# Altium project LCD_Board_2.PrjPcb
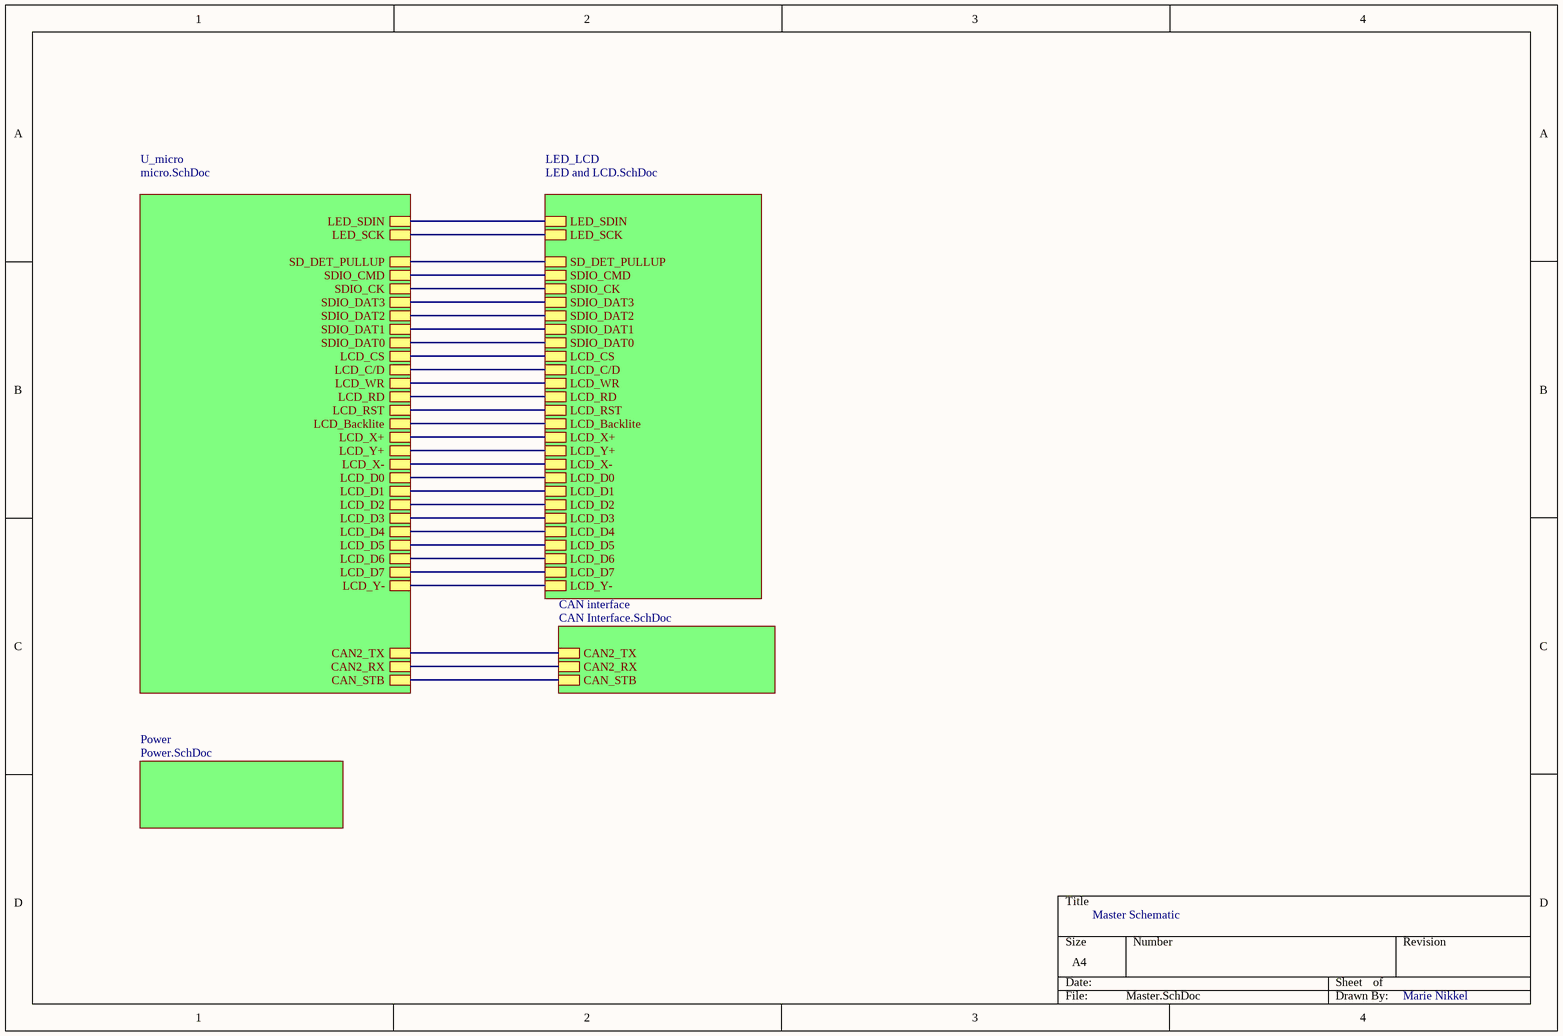
[diagram p0: Master.SchDoc]
5 sheets, 78 parts. Net scope: hierarchical (ports join the sheet entries above them; power ports are global).
Board file: LCD_Board_2.PcbDoc
Sheets:
  Master.SchDoc
    U_micro = micro.SchDoc
    Power = Power.SchDoc
    CAN interface = CAN Interface.SchDoc
    LED_LCD = LED and LCD.SchDoc

## Sheet Master.SchDoc
size A4

### Sub-sheets
CAN interface = CAN Interface.SchDoc: CAN2_TX, CAN2_RX, CAN_STB
LED_LCD = LED and LCD.SchDoc: LCD_C/D, LCD_WR, LCD_RD, LCD_RST, LCD_CS, LCD_Backlite, LCD_D0, LCD_D1, LCD_D2, LCD_D3, LCD_D4, LCD_D5, LCD_D7, LCD_D6, SDIO_DAT0, SDIO_DAT1, SDIO_DAT2, SDIO_DAT3, SDIO_CK, SDIO_CMD, LED_SDIN, SD_DET_PULLUP, LCD_X+, LCD_Y+, LCD_X-, LCD_Y-, LED_SCK
Power = Power.SchDoc: no entries
U_micro = micro.SchDoc: LCD_CS, LCD_C/D, LCD_WR, LCD_RD, LCD_RST, LCD_Backlite, LCD_X+, LCD_Y+, LCD_X-, LCD_D0, LCD_D1, LCD_D2, LCD_D3, LCD_D4, LCD_D5, LCD_D6, LCD_D7, CAN2_TX, CAN2_RX, SDIO_DAT0, SDIO_DAT2, SDIO_DAT1, SDIO_DAT3, SDIO_CK, SDIO_CMD, CAN_STB, SD_DET_PULLUP, LED_SDIN, LED_SCK, LCD_Y-

### Nets
NetC14_2: sheet U_micro/LCD_RST, sheet LED_LCD/LCD_RST
NetCD1_1: sheet U_micro/SDIO_DAT2, sheet LED_LCD/SDIO_DAT2
NetCD1_2: sheet U_micro/SDIO_DAT3, sheet LED_LCD/SDIO_DAT3
NetCD1_3: sheet U_micro/SDIO_CMD, sheet LED_LCD/SDIO_CMD
NetCD1_5: sheet U_micro/SDIO_CK, sheet LED_LCD/SDIO_CK
NetCD1_7: sheet U_micro/SDIO_DAT0, sheet LED_LCD/SDIO_DAT0
NetCD1_8: sheet U_micro/SDIO_DAT1, sheet LED_LCD/SDIO_DAT1
NetCN4_2: sheet U_micro/LED_SCK, sheet LED_LCD/LED_SCK
NetCN4_3: sheet U_micro/LED_SDIN, sheet LED_LCD/LED_SDIN
NetJP1_1: sheet U_micro/CAN2_TX, sheet CAN interface/CAN2_TX
NetJP1_2: sheet U_micro/CAN2_RX, sheet CAN interface/CAN2_RX
NetJP4_2: sheet U_micro/SD_DET_PULLUP, sheet LED_LCD/SD_DET_PULLUP
NetLCD1_23: sheet U_micro/LCD_CS, sheet LED_LCD/LCD_CS
NetLCD1_24: sheet U_micro/LCD_C/D, sheet LED_LCD/LCD_C/D
NetLCD1_25: sheet U_micro/LCD_WR, sheet LED_LCD/LCD_WR
NetLCD1_26: sheet U_micro/LCD_RD, sheet LED_LCD/LCD_RD
NetLCD1_28: sheet U_micro/LCD_Backlite, sheet LED_LCD/LCD_Backlite
NetLCD1_29: sheet U_micro/LCD_X+, sheet LED_LCD/LCD_X+
NetLCD1_30: sheet U_micro/LCD_Y+, sheet LED_LCD/LCD_Y+
NetLCD1_31: sheet U_micro/LCD_X-, sheet LED_LCD/LCD_X-
NetLCD1_32: sheet U_micro/LCD_Y-, sheet LED_LCD/LCD_Y-
NetLCD1_33: sheet U_micro/LCD_D0, sheet LED_LCD/LCD_D0
NetLCD1_34: sheet U_micro/LCD_D1, sheet LED_LCD/LCD_D1
NetLCD1_35: sheet U_micro/LCD_D2, sheet LED_LCD/LCD_D2
NetLCD1_36: sheet U_micro/LCD_D3, sheet LED_LCD/LCD_D3
NetLCD1_37: sheet U_micro/LCD_D4, sheet LED_LCD/LCD_D4
NetLCD1_38: sheet U_micro/LCD_D5, sheet LED_LCD/LCD_D5
NetLCD1_39: sheet U_micro/LCD_D6, sheet LED_LCD/LCD_D6
NetLCD1_40: sheet U_micro/LCD_D7, sheet LED_LCD/LCD_D7
NetU2_48: sheet U_micro/CAN_STB, sheet CAN interface/CAN_STB

### Notes on the sheet
- Master Schematic
- Marie Nikkel

## Sheet micro.SchDoc
size A4
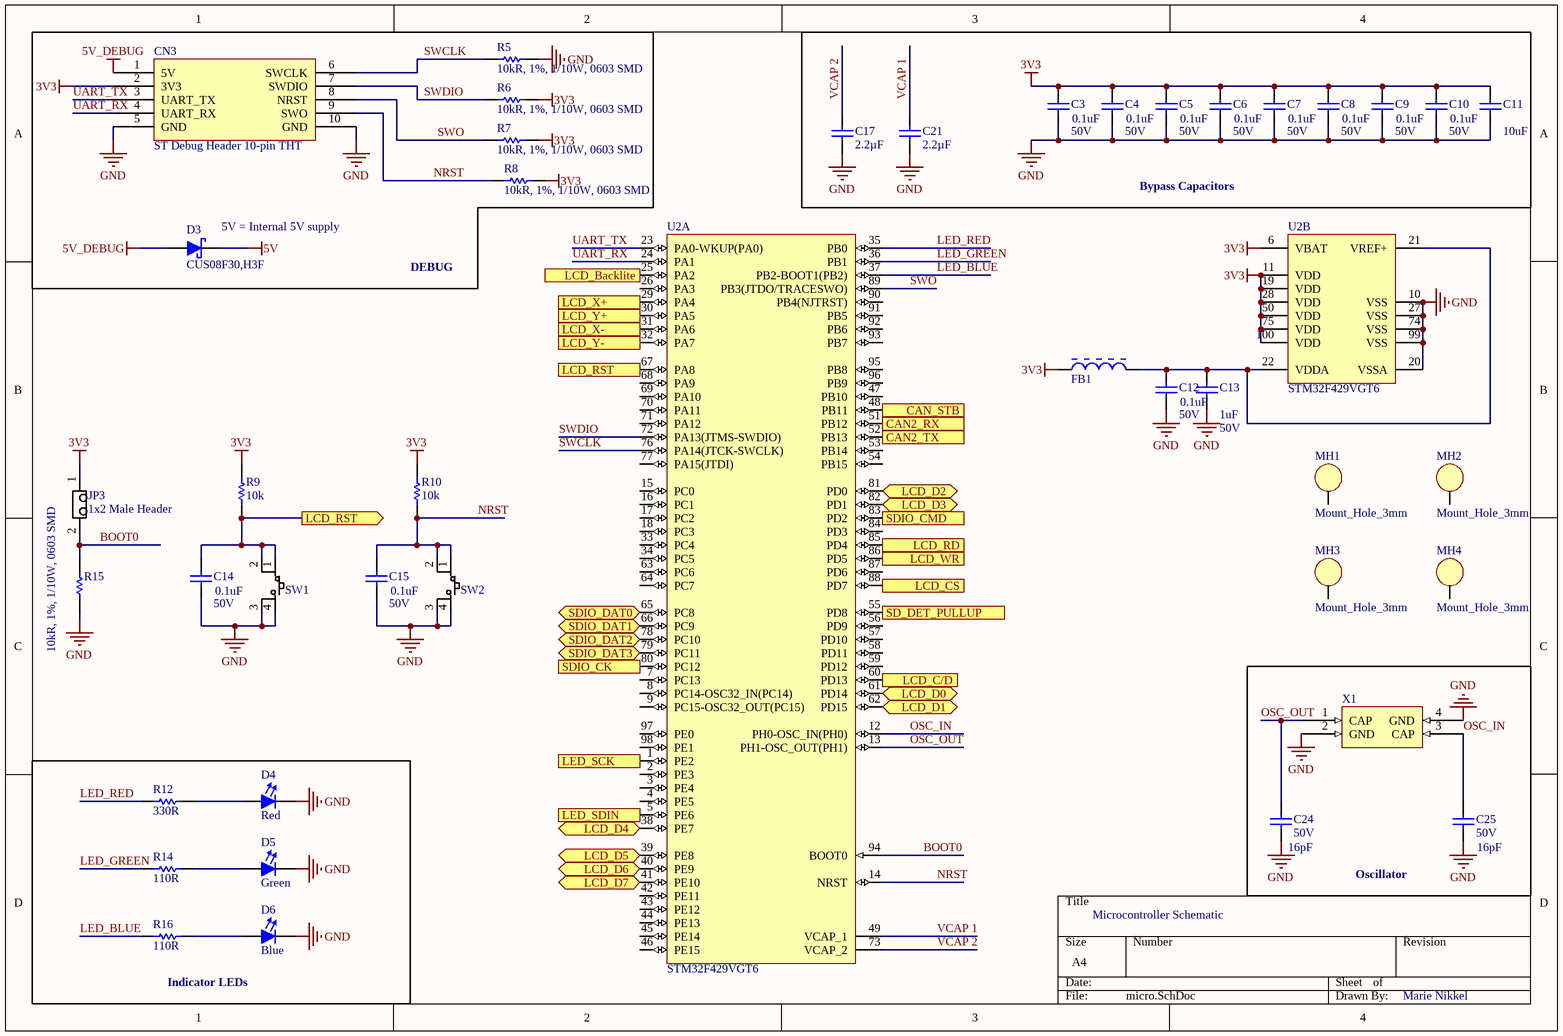
[diagram p1: micro.SchDoc]

### Parts
C3  Voltage: 50V  Capacitance: 0.1uF  [FP-CL10-0_1-IPC_A]  (hidden comment: CL10B104JB8NNNC)
C4  Voltage: 50V  Capacitance: 0.1uF  [FP-CL10-0_1-IPC_A]  (hidden comment: CL10B104JB8NNNC)
C5  Voltage: 50V  Capacitance: 0.1uF  [FP-CL10-0_1-IPC_A]  (hidden comment: CL10B104JB8NNNC)
C6  Voltage: 50V  Capacitance: 0.1uF  [FP-CL10-0_1-IPC_A]  (hidden comment: CL10B104JB8NNNC)
C7  Voltage: 50V  Capacitance: 0.1uF  [FP-CL10-0_1-IPC_A]  (hidden comment: CL10B104JB8NNNC)
C8  Voltage: 50V  Capacitance: 0.1uF  [FP-CL10-0_1-IPC_A]  (hidden comment: CL10B104JB8NNNC)
C9  Voltage: 50V  Capacitance: 0.1uF  [FP-CL10-0_1-IPC_A]  (hidden comment: CL10B104JB8NNNC)
C10  Voltage: 50V  Capacitance: 0.1uF  [FP-CL10-0_1-IPC_A]  (hidden comment: CL10B104JB8NNNC)
C11  Capacitance: 10uF  [CAPC3216X180X50ML20T30]  (hidden comment: CL31B106KBHNNNE)
C12  Voltage: 50V  Capacitance: 0.1uF  [FP-CL10-0_1-IPC_A]  (hidden comment: CL10B104JB8NNNC)
C13  Capacitance: 1uF  Voltage: 50V  [0803 CAP]  (hidden comment: CL21B105KBFNNNG)
C14  Voltage: 50V  Capacitance: 0.1uF  [FP-CL10-0_1-IPC_A]  (hidden comment: CL10B104JB8NNNC)
C15  Voltage: 50V  Capacitance: 0.1uF  [FP-CL10-0_1-IPC_A]  (hidden comment: CL10B104JB8NNNC)
C17  value 2.2µF  [CAPC1608N(0603")]  (hidden comment: 2.2uF, 50V, 0603 SMD, X5R, Ceramic)
C21  value 2.2µF  [CAPC1608N(0603")]  (hidden comment: 2.2uF, 50V, 0603 SMD, X5R, Ceramic)
C24  Voltage: 50V  Capacitance: 16pF  [CAPC1608X90X35ML10T15]  (hidden comment: 16pF Ceramic 50V 5% 0603)
C25  Voltage: 50V  Capacitance: 16pF  [CAPC1608X90X35ML10T15]  (hidden comment: 16pF Ceramic 50V 5% 0603)
CN3  ST Debug Header 10-pin THT  [10-pin shrouded header THT]
D3  CUS08F30,H3F  [SC-76]
D4  Color: Red  [FP-LB_Q39E-MFG]  (hidden comment: LSQ976-NR-1)
D5  Color: Green  [FP-LB_Q39E-MFG]  (hidden comment: LT Q39G-Q1OO-25-1)
D6  Color: Blue  [FP-LB_Q39E-MFG]  (hidden comment: LBQ39E-N1OO-35-1)
FB1  BLM18AG601SN1D  [MURA-BLM18-F-H1-CHIP-2_V]  (value not drawn)
JP3  1x2 Male Header  [2X1 Males Header]
MH1  Mount_Hole_3mm  [Mount-Hole_3mm]
MH2  Mount_Hole_3mm  [Mount-Hole_3mm]
MH3  Mount_Hole_3mm  [Mount-Hole_3mm]
MH4  Mount_Hole_3mm  [Mount-Hole_3mm]
R5  10kR, 1%, 1/10W, 0603 SMD  [RESC1608N(0603")]
R6  10kR, 1%, 1/10W, 0603 SMD  [RESC1608N(0603")]
R7  10kR, 1%, 1/10W, 0603 SMD  [RESC1608N(0603")]
R8  10kR, 1%, 1/10W, 0603 SMD  [RESC1608N(0603")]
R9  value 10k  [RESC1608N(0603")]  (hidden comment: 10kR, 1%, 1/10W, 0603 SMD)
R10  value 10k  [RESC1608N(0603")]  (hidden comment: 10kR, 1%, 1/10W, 0603 SMD)
R12  Resistance: 330R  [FP-CRCW0603-e3-IPC_C]  (hidden comment: CRCW0603330RFKEA)
R14  Resistance: 110R  [RESC1608X55X25ML10T15]  (hidden comment: RC0603FR-07110RL)
R15  10kR, 1%, 1/10W, 0603 SMD  [RESC1608N(0603")]
R16  Resistance: 110R  [RESC1608X55X25ML10T15]  (hidden comment: RC0603FR-07110RL)
SW1  PTS645SL43SMTR92LFS  [4-SPST-NO]  (value not drawn)
SW2  PTS645SL43SMTR92LFS  [4-SPST-NO]  (value not drawn)
U2  STM32F429VGT6  [STM-LQFP100_L]  (parts A,B of 2)
X1  CRYSTAL 8.0MHZ 16PF SMD  [QFN250P750X520X140_HS-5M]  (value not drawn)

### Blocks framed on the sheet
Bypass Capacitors: C3-C11 C17 C21
Oscillator: C24 C25 X1
Indicator LEDs: D4-D6 R12 R14 R16

### Ports
CAN2_RX (in), CAN2_TX (out), CAN_STB (out), LCD_Backlite (out), LCD_C/D (out), LCD_CS (out), LCD_D0 (bidir), LCD_D1 (bidir), LCD_D2 (bidir), LCD_D3 (bidir), LCD_D4 (bidir), LCD_D5 (bidir), LCD_D6 (bidir), LCD_D7 (bidir), LCD_RD (out), LCD_RST (out), LCD_WR (out), LCD_X+ (in), LCD_X- (in), LCD_Y+ (in), LCD_Y- (in), LED_SCK (out), LED_SDIN (out), SD_DET_PULLUP (out), SDIO_CK (out), SDIO_CMD (out), SDIO_DAT0 (bidir), SDIO_DAT1 (bidir), SDIO_DAT2 (bidir), SDIO_DAT3 (bidir)

### Nets
3V3: C3.2 C4.2 C5.2 C6.2 C7.2 C8.2 C9.2 C10.2 C11.2 CN3.2(3V3) FB1.1 JP3.1 R6.2 R7.2 R8.2 R9.2 R10.2 U2.6(VBAT) U2.11(VDD) U2.19(VDD) U2.28(VDD) U2.50(VDD) U2.75(VDD) U2.100(VDD)
5V: D3.K(Cathode)
5V_DEBUG: CN3.1(5V) D3.A(Anode)
GND: C3.1 C4.1 C5.1 C6.1 C7.1 C8.1 C9.1 C10.1 C11.1 C12.1 C13.1 C14.1 C15.1 C17.1(Anode) C21.1(Anode) C24.1 C25.1 CN3.5(GND) CN3.10(GND) D4.1(Cathode) D5.1(Cathode) D6.1(Cathode) R5.2 R15.1 SW1.3 SW1.4 SW2.3 SW2.4 U2.10(VSS) U2.20(VSSA) U2.27(VSS) U2.74(VSS) U2.99(VSS) X1.2(GND) X1.4(GND)
BOOT0: JP3.2 R15.2 U2.94(BOOT0)
LED_BLUE: R16.1 U2.37(PB2-BOOT1(PB2))
LED_GREEN: R14.1 U2.36(PB1)
LED_RED: R12.1 U2.35(PB0)
NRST: C15.2 CN3.9(SWO) R8.1 R10.1 SW2.1 SW2.2 U2.14(NRST)
OSC_IN: C25.2 U2.12(PH0-OSC_IN(PH0)) X1.3(CAP)
OSC_OUT: C24.2 U2.13(PH1-OSC_OUT(PH1)) X1.1(CAP)
SWCLK: CN3.6(SWCLK) R5.1 U2.76(PA14(JTCK-SWCLK))
SWDIO: CN3.7(SWDIO) R6.1 U2.72(PA13(JTMS-SWDIO))
SWO: CN3.8(NRST) R7.1 U2.89(PB3(JTDO/TRACESWO))
UART_RX: CN3.4(UART_RX) U2.24(PA1)
UART_TX: CN3.3(UART_TX) U2.23(PA0-WKUP(PA0))
VCAP 1: C21.2(Cathode) U2.49(VCAP_1)
VCAP 2: C17.2(Cathode) U2.73(VCAP_2)
NetC12_2: C12.2 C13.2 FB1.2 U2.21(VREF+) U2.22(VDDA)
NetC14_2: C14.2 R9.1 SW1.1 SW1.2 U2.67(PA8) ; port LCD_RST
NetCD1_1: U2.78(PC10) ; port SDIO_DAT2
NetCD1_2: U2.79(PC11) ; port SDIO_DAT3
NetCD1_3: U2.83(PD2) ; port SDIO_CMD
NetCD1_5: U2.80(PC12) ; port SDIO_CK
NetCD1_7: U2.65(PC8) ; port SDIO_DAT0
NetCD1_8: U2.66(PC9) ; port SDIO_DAT1
NetCN4_2: U2.1(PE2) ; port LED_SCK
NetCN4_3: U2.5(PE6) ; port LED_SDIN
NetD4_2: D4.2(Anode) R12.2
NetD5_2: D5.2(Anode) R14.2
NetD6_2: D6.2(Anode) R16.2
NetJP1_1: U2.52(PB13) ; port CAN2_TX
NetJP1_2: U2.51(PB12) ; port CAN2_RX
NetJP4_2: U2.55(PD8) ; port SD_DET_PULLUP
NetLCD1_23: U2.88(PD7) ; port LCD_CS
NetLCD1_24: U2.60(PD13) ; port LCD_C/D
NetLCD1_25: U2.86(PD5) ; port LCD_WR
NetLCD1_26: U2.85(PD4) ; port LCD_RD
NetLCD1_28: U2.25(PA2) ; port LCD_Backlite
NetLCD1_29: U2.29(PA4) ; port LCD_X+
NetLCD1_30: U2.30(PA5) ; port LCD_Y+
NetLCD1_31: U2.31(PA6) ; port LCD_X-
NetLCD1_32: U2.32(PA7) ; port LCD_Y-
NetLCD1_33: U2.61(PD14) ; port LCD_D0
NetLCD1_34: U2.62(PD15) ; port LCD_D1
NetLCD1_35: U2.81(PD0) ; port LCD_D2
NetLCD1_36: U2.82(PD1) ; port LCD_D3
NetLCD1_37: U2.38(PE7) ; port LCD_D4
NetLCD1_38: U2.39(PE8) ; port LCD_D5
NetLCD1_39: U2.40(PE9) ; port LCD_D6
NetLCD1_40: U2.41(PE10) ; port LCD_D7
NetU2_48: U2.48(PB11) ; port CAN_STB

Not connected (* = marked no-connect by the designer): MH1 1; MH2 1; MH3 1; MH4 1; U2 2(PE3) 3(PE4) 4(PE5) 7(PC13) 8(PC14-OSC32_IN(PC14)) 9(PC15-OSC32_OUT(PC15)) 15(PC0) 16(PC1) 17(PC2) 18(PC3) 26(PA3) 33(PC4) 34(PC5) 42(PE11) 43(PE12) 44(PE13) 45(PE14) 46(PE15) 47(PB10) 53(PB14) 54(PB15) 56(PD9) 57(PD10) 58(PD11) 59(PD12) 63(PC6) 64(PC7) 68(PA9) 69(PA10) 70(PA11) 71(PA12) 77(PA15(JTDI)) 84(PD3) 87(PD6) 90(PB4(NJTRST)) 91(PB5) 92(PB6) 93(PB7) 95(PB8) 96(PB9) 97(PE0) 98(PE1)

### Notes on the sheet
- (near D3) 5V = Internal 5V supply
- DEBUG
- Microcontroller Schematic
- Marie Nikkel

### Library data of the parts
C3 = CMP-00000-4: CAP CER 0.1UF 50V X7R 0603; Tolerance: 5%; Material: Ceramic; Case Code (Imperial): 0603; Mount: Surface Mount; Thickness: 0.035inch; Depth: 0.8mm; Packaging: Tape and Reel; Package Quantity: 1; Dielectric: X7R; Height: 0.8mm; Radiation Hardening: No; Max Operating Temperature: 125°C; Voltage Rating: 50V; Case/Package: 0603; Min Operating Temperature: -55°C; Case Code (Metric): 1608; Length: 1.6mm; Contact Plating: Tin; Width: 0.031inch
C4-C10 C12 C14 C15 = CMP-00000-3: CAP CER 0.1UF 50V X7R 0603; Tolerance: 5%; Material: Ceramic; Case Code (Imperial): 0603; Mount: Surface Mount; Thickness: 0.035inch; Depth: 0.8mm; Packaging: Tape and Reel; Package Quantity: 1; Dielectric: X7R; Height: 0.8mm; Radiation Hardening: No; Max Operating Temperature: 125°C; Voltage Rating: 50V; Case/Package: 0603; Min Operating Temperature: -55°C; Case Code (Metric): 1608; Length: 1.6mm; Contact Plating: Tin; Width: 0.031inch
C11 = CMP-00004-1: Cap Ceramic 10uF 50V X7R 10% Pad SMD 1206 125°C T/R; Thickness: 0.071inch; Case/Package: 1206; Case Code (Metric): 3216; Case Code (Imperial): 1206; Voltage Rating: 50V; Length: 0.126inch; Max Operating Temperature: 125°C; Voltage Rating (DC): 50V; Dielectric: X7R; Lead Free: Lead Free; Min Operating Temperature: -55°C; Tolerance: 10%; Mount: Surface Mount; Packaging: Tape and Reel; Width: 0.063inch
C13 = CMP-00005-3: SAMSUNG ELECTRO-MECHANICS - CL21B105KBFNNNG - MLCC CAPACITORS; Tolerance: 10%; Material: Ceramic; Dielectric: X7R; Case/Package: 0805; Voltage Rating: 50V; Contact Plating: Tin; Max Operating Temperature: 125°C; Termination: Wraparound; Package Quantity: 3000; Depth: 1.25mm; Mount: Surface Mount; Min Operating Temperature: -55°C; Thickness: 0.053inch; Packaging: Tape and Reel; Case Code (Metric): 2012; Length: 2mm; Case Code (Imperial): 0805; Width: 0.049inch
C17 C21 = CMP-006-0030-1: Capacitor, Ceramic, 50V, 10%, 0603 SMD, X5R; Date Created: *; Design Item ID: 2.2uF, 50V, 0603 SMD, X5R, Ceramic; Made By: *; Publisher: AUVic; Source: AUVic_Schematic_Library_Capacitors.SchLib; Pin Count: 2; PackageDescription: Chip Capacitor; Component Type: Standard
C24 C25 = CMP-00087-2: Cap Ceramic 16pF 50V C0G 5% SMD 0603 125C Paper T/R; Temperature Coefficient: 30ppm/°C; Termination: SMD/SMT; Voltage Rating: 50V; Dielectric: C0G; Radiation Hardening: No; Voltage Rating (DC): 50V; Max Operating Temperature: 125°C; Height: 0.8mm; Width: 0.8mm; Length: 1.6mm; Package Quantity: 1; Lead Free: Lead Free; Min Operating Temperature: -55°C; Case Code (Metric): 1608; Case/Package: 0603; Tolerance: 5%; Mount: Surface Mount; Thickness: 0.035inch; Case Code (Imperial): 0603; Depth: 0.8mm; Packaging: Tape and Reel
CN3 = CMP-00011-6: CONN HEADER VERT 10POS 2.54MM; Row Spacing: 0.1inch; Connector Type: Male Pin; Number of Positions: 10; Packaging: Tray; Package Quantity: 1; Color: Black; Number of Rows: 2; Termination: Solder; Contact Plating: Gold; Lead Free: Lead Free; Pitch: 0.1inch; Mount: Through Hole
D3 = CMP-057-0000-2: Diode Schottky 30V 800mA Surface Mount USC; Peak Non-Repetitive Surge Current: 5A; Element Configuration: Single; Peak Reverse Current: 50uA; Packaging: Tape and Reel; Mount: Surface Mount; Average Rectified Current: 800mA; Case/Package: SOD; Max Reverse Voltage (DC): 30V; Min Operating Temperature: -55°C; Contact Plating: Tin,Silver; Max Repetitive Reverse Voltage (Vrrm): 30V; Number of Pins: 2; Max Operating Temperature: 125°C
D4 = CMP-00066-2: LED Red 645nm 2-Pin Chip 0603(1608Metric) T/R; Lens Transparency: Diffused; Power Dissipation: 65mW; Forward Voltage: 2.5V; Dominant Wavelength: 633nm; Number of Elements: 1; Lens Style: Diffused,Flat,Colorless,Rectangular; Lens Color: White; Viewing Angle: 160°; Luminous Flux: 0.33lm; Test Current: 20mA; Forward Current: 25mA; Luminous Intensity: 180mcd; Reverse Voltage: 12V; Lens Size: 0.8mm; Max Operating Temperature: 85°C; Depth: 0.9mm; Illumination Color: Red; Packaging: Tape and Reel; Min Operating Temperature: -30°C; Case Code (Imperial): 0603; Case Code (Metric): 1608; Number of Pins: 2; Mount: Surface Mount; Height: 0.8mm; Package Quantity: 1; Length: 1.7mm; Width: 0.8mm; Number of LEDs: 1; Case/Package: 0603; Radiation Hardening: No
D5 = CMP-00064-3: LED GREEN DIFFUSED 0603 SMD; Dominant Wavelength: 530nm; Luminous Intensity: 280mcd; Lens Style: Diffused,Colorless,Rectangular; Number of LEDs: 1; Forward Voltage: 2.85V; Test Current: 5mA; Reverse Voltage: 5V; Forward Current: 15mA; Luminous Flux: 0.55lm; Radiation Hardening: No; Packaging: Tape and Reel; Mount: Surface Mount; Max Operating Temperature: 85°C; Number of Elements: 1; Number of Pins: 2; Min Operating Temperature: -40°C; Depth: 0.9mm; Case/Package: SMD/SMT; Length: 1.7mm
D6 = CMP-00063-3: LED BLUE DIFFUSED 0603 SMD; Luminous Flux: 0.13lm; Lens Size: 0.8mm; Lens Color: White; Viewing Angle: 130°; Luminous Intensity: 42mcd; Number of LEDs: 1; Dominant Wavelength: 470nm; Lens Style: Flat,Diffused,Colorless,Rectangular; Test Current: 5mA; Forward Voltage: 2.85V; Packaging: Tape and Reel; Case/Package: 0603; Height: 0.4mm; Number of Pins: 2; Mount: Surface Mount; Case Code (Metric): 1608; Case Code (Imperial): 0603; Lens Transparency: Diffused; Width: 0.8mm; Length: 1.6mm; Radiation Hardening: No
FB1 = CMP-00016-1: MURATA - BLM18AG601SN1D - Feritový Korálek, 0603 / 1608, 600 ohm, 500 mA, Série BLM18A, 0.38 ohm, ± 25%; DC Current: 500mA; Impedance: 600R; DC Resistance (DCR): 380mR; Core Material: Ferrite; Shielding: Unshielded; Number of Lines: 1; Test Frequency: 100MHz; Material: Steel,Ferrite; Height: 0.8mm; Depth: 0.8mm; Min Operating Temperature: -55°C; Packaging: Tape and Reel; Weight: 7.1E-05oz; Width: 0.8mm; Military Standard: Not; Max Operating Temperature: 125°C; Max Current Rating: 500mA; Case Code (Metric): 1608; Length: 1.6mm; Case Code (Imperial): 0603; Package Quantity: 1; Max DC Current: 500mA; REACH SVHC: No SVHC; Termination: SMD/SMT; Current Rating: 500mA; Lead Free: Lead Free; Tolerance: 25%; Case/Package: 0603; Number of Pins: 2; Radiation Hardening: No; Frequency: 100MHz; Number of Circuits: 1
JP3 = CMP-004-0001-1: Made By: Andy Bates; Source: AUVic_Schematic_Library_Connectors.SchLib; Pin Count: 2; Design Item ID: 1x2 Male Header; Component Type: Standard
MH1-MH4 = CMP-004-0010-4: Mounting hold for M3 hex standoff; Design Item ID: Mount_Hole_3mm; Pin Count: 1; Source: AUVic_Schematic_Library_Connectors.SchLib; Component Type: Standard
R5-R8 R15 = CMP-047-0013-1: Owned By: AUVic; Made By: Ashwin Sira; Value: 10k; Design Item ID: 10kR, 1%, 1/10W, 0603 SMD; Pin Count: 2; Component Type: Standard; Created On: 14-05-31; Last Edited: 14-05-31; Source: AUVic_Schematic_Library_Resistors.SchLib
R9 R10 = CMP-047-0013-1: Owned By: AUVic; Made By: Ashwin Sira; Design Item ID: 10kR, 1%, 1/10W, 0603 SMD; Pin Count: 2; Component Type: Standard; Created On: 14-05-31; Last Edited: 14-05-31; Source: AUVic_Schematic_Library_Resistors.SchLib
R12 = CMP-00067-2: Res Thick Film 0603 330 Ohm 1% 0.1W(1/10W) +/-100ppm/ßC Pad SMD Automotive T/R; Voltage Rating (DC): 75V; Power Rating: 100mW; Temperature Coefficient: 100ppm/°C; Contact Plating: Tin; Package Quantity: 10; Tolerance: 1%; Packaging: Tape and Reel; Case/Package: 0603; Max Operating Temperature: 155°C; Case Code (Metric): 1608; Case Code (Imperial): 0603; Min Operating Temperature: -55°C; Length: 1.55mm; Height: 0.45mm; Lead Free: Lead Free; Termination: SMD/SMT; Voltage Rating: 75V; Composition: Thick Film; Weight: 7.1E-05oz; Military Standard: Not; Max Power Dissipation: 100mW; REACH SVHC: Unknown; Mount: Surface Mount; Depth: 0.85mm; Features: Automotive AEC-Q200; Number of Terminations: 2; Radiation Hardening: No; Width: 0.033inch
R14 R16 = CMP-00069-1: RES SMD 110 OHM 1% 1/10W 0603; Max Power Dissipation: 100mW; Voltage Rating (DC): 50V; Temperature Coefficient: 100ppm/°C; Working Voltage: 75V; Military Standard: Not; Termination: SMD/SMT; Number of Terminations: 2; Features: Moisture Resistant; Min Operating Temperature: -55°C; Power Rating: 100mW; Height: 0.022inch; Package Quantity: 1; Lead Free: Lead Free; Tolerance: 1%; Voltage Rating: 50V; Composition: Thick Film; Case Code (Imperial): 0603; Length: 1.6mm; Packaging: Tape and Reel; Case Code (Metric): 1608; Max Operating Temperature: 155°C; Depth: 0.8mm; Case/Package: 0603; Width: 0.031inch
SW1 SW2 = CMP-00077-1: Black Switch Tactile N.O. SPST Round Button Gull Wing 0.05A 12VDC 100000Cycles 1.27N SMD T/R; Actuator Type: Standard; Current Rating: 50mA; Switch Function: Off-Mom; Actuator Length: 0.85mm; Contact Resistance: 100mR; Max Voltage Rating (DC): 12V; Actuator Material: Nylon,Polyamide; Illumination Type: Non-Illuminated; Orientation: Straight; Mechanical Life: 100000Cycles; Package Quantity: 1000; Operating Force: 1.27N; Color: Black; Button Colour: Black; Max Operating Temperature: 60°C; Length: 6mm; Contact Plating: Silver; Termination: Gull Wing; Min Operating Temperature: -20°C; Mount: Surface Mount; Voltage Rating (DC): 12V; Max Current Rating: 50mA; Lead Free: Lead Free; Depth: 9mm; Packaging: Tape and Reel; Throw Configuration: SPST; Contact Material: Bronze,Brass,Silver
U2 = CMP-00008-1: MCU 32-bit STM32F ARM Cortex M4 RISC 1024KB Flash 2.5V/3.3V 100-Pin LQFP Tray; Number of ADC Channels: 24; Max Power Dissipation: 465mW; Number of I/Os: 82; Oscillator Type: Internal; Frequency: 180MHz; Peripherals: Brown-out Detect/Reset,POR,PWM,WDT,DMA,LCD; Data Bus Width: 32b; Number of UART Channels: 4; Interface: I2C,SPI,USB,CAN,IrDA,UART,USART,LIN,EBI/EMI,SDIO,Ethernet,I2S; Min Supply Voltage: 1.8V; Memory Size: 1MB; Number of Ethernet Channels: 1; Number of I2C Channels: 3; Number of SPI Channels: 6; Number of Timers/Counters: 14; Number of USB Channels: 2; Max Supply Voltage: 3.6V; RAM Size: 256KB; Watchdog Timer: Yes; Case/Package: LQFP; Length: 14.2mm; Number of Programmable I/O: 82; Min Operating Temperature: -40°C; REACH SVHC: No SVHC; Number of Pins: 100; Lead Free: Lead Free; Core Architecture: ARM; Radiation Hardening: No; Memory Type: FLASH; Packaging: Tray; Width: 14.2mm; Package Quantity: 540; Max Operating Temperature: 85°C; Max Frequency: 180MHz; Height: 1.45mm
X1 = CMP-00079-3: 8MHz ±30ppm Crystal 16pF 80 Ohms 4-SMD, No Lead; Frequency Stability: 50ppm; ESR (Equivalent Series Resistance): 80R; Packaging: Tape and Reel; Min Operating Temperature: -20°C; Length: 7.5mm; Case/Package: CSMD; Max Operating Temperature: 70°C; Load Capacitance: 16pF; Depth: 5.2mm; Frequency: 8MHz; Number of Pins: 4

## Sheet Power.SchDoc
size A
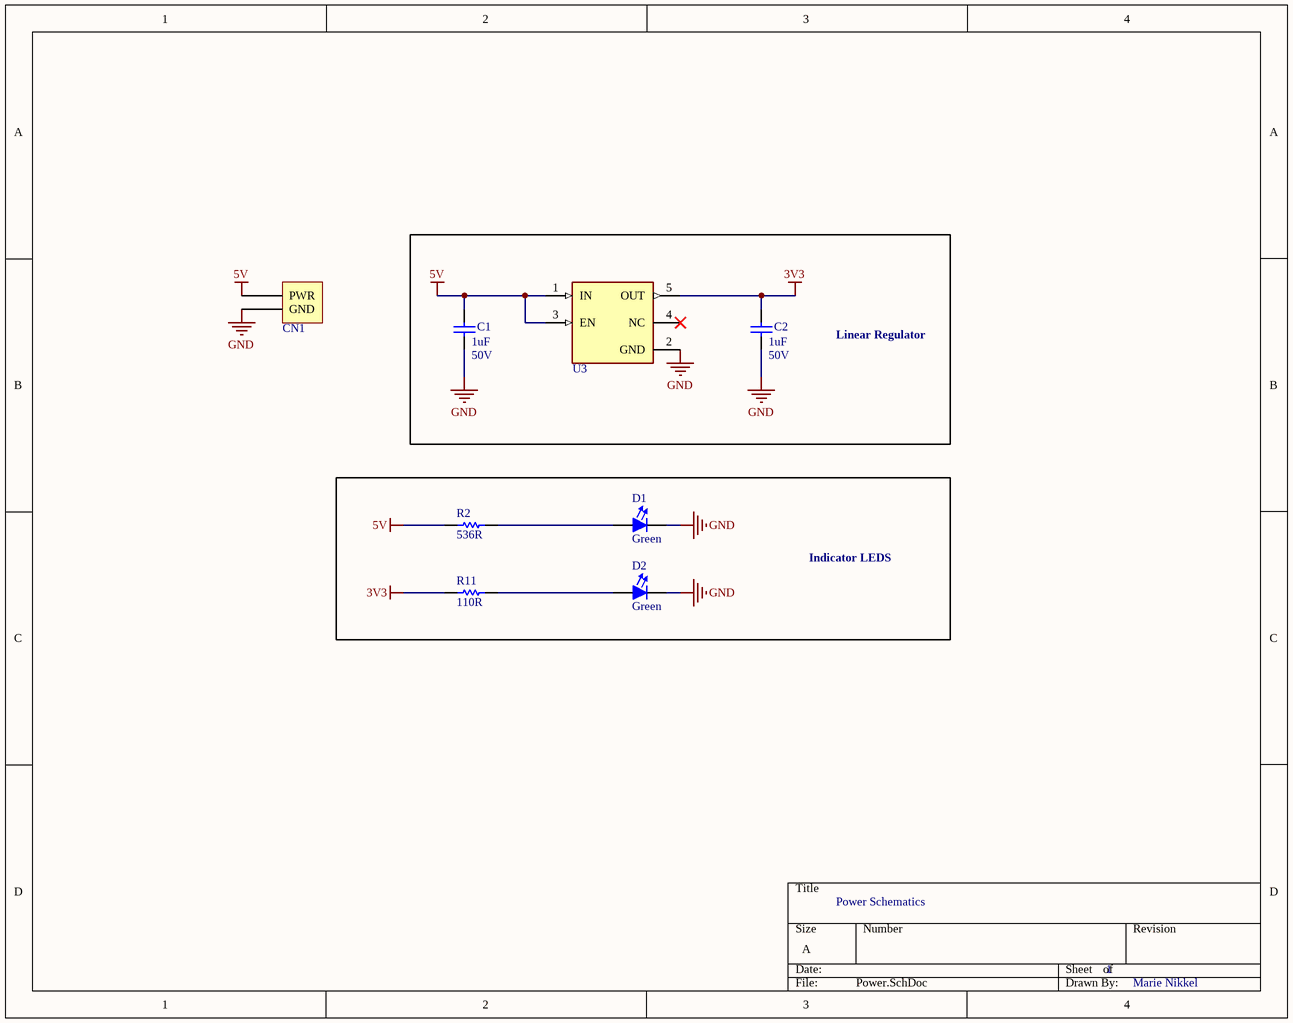
[diagram p2: Power.SchDoc]

### Parts
C1  Capacitance: 1uF  Voltage: 50V  [0803 CAP]  (hidden comment: CL21B105KBFNNNG)
C2  Capacitance: 1uF  Voltage: 50V  [0803 CAP]  (hidden comment: CL21B105KBFNNNG)
CN1  Header, Female, 1x2, Right Angle, Pitch 0.118" (3.00mm), THT  [New footprint 1]  (value not drawn)
D1  Color: Green  [FP-LB_Q39E-MFG]  (hidden comment: LT Q39G-Q1OO-25-1)
D2  Color: Green  [FP-LB_Q39E-MFG]  (hidden comment: LT Q39G-Q1OO-25-1)
R2  Resistance: 536R  [RESC1608X55X30NL15T15]  (hidden comment: ERJ-3EKF5360V)
R11  Resistance: 110R  [RESC1608X55X25ML10T15]  (hidden comment: RC0603FR-07110RL)
U3  TLV75533PDBVR  [FP-DBV0005A-IPC_B]  (value not drawn)

### Blocks framed on the sheet
Linear Regulator: C1 C2 U3
Indicator LEDS: D1 D2 R2 R11

### Nets
3V3: C2.1 R11.1 U3.5(OUT)
5V: C1.1 CN1.2(PWR) R2.1 U3.1(IN) U3.3(EN)
GND: C1.2 C2.2 CN1.1(GND) D1.1(Cathode) D2.1(Cathode) U3.2(GND)
NetD1_2: D1.2(Anode) R2.2
NetD2_2: D2.2(Anode) R11.2

Not connected (* = marked no-connect by the designer): U3 4(NC)*

### Notes on the sheet
- Power Schematics
- 1
- Marie Nikkel

### Library data of the parts
C1 C2 = CMP-00005-3: as C13 on sheet micro; Case/Package: 0805; Voltage Rating: 50V; Contact Plating: Tin; Max Operating Temperature: 125°C; Termination: Wraparound; Package Quantity: 3000; Depth: 1.25mm; Mount: Surface Mount; Min Operating Temperature: -55°C; Thickness: 0.053inch; Packaging: Tape and Reel; Case Code (Metric): 2012; Length: 2mm; Case Code (Imperial): 0805; Width: 0.049inch
CN1 = CMP-00001-4: Connector Header Through Hole, Right Angle 2 position; Gender: Male; Max Voltage Rating (DC): 250.25kV; Number of Contacts: 2; Current Rating: 5A; Glow Wire Compliant: Compliant; Voltage Rating: 600V; Voltage Rating (DC): 250V; Insulation Resistance: 1GR; Pitch: 3mm; Contact Resistance: 10mR; Length: 7.15mm; Contact Material: Brass; Housing Color: Black; Contact Plating: Gold; Packaging: Tray; Mount: Through Hole; Diameter: 3mm; Housing Material: Thermoplastic; Case/Package: SMC; Depth: 12.2mm; Termination: Solder; Color: Black; Max Current Rating: 5A; Number of Positions: 2; Lead Free: Contains Lead; Min Operating Temperature: -40°C; Number of Rows: 2; Height: 8.77mm; Package Quantity: 3168; Number of Circuits: 2; Max Operating Temperature: 105°C; Radiation Hardening: No; Flammability Rating: UL94 V-0; Orientation: Right Angle; Halogen Free: Low Halogen
D1 D2 = CMP-00064-3: as D5 on sheet micro; Radiation Hardening: No; Packaging: Tape and Reel; Mount: Surface Mount; Max Operating Temperature: 85°C; Number of Elements: 1; Number of Pins: 2; Min Operating Temperature: -40°C; Depth: 0.9mm; Case/Package: SMD/SMT; Length: 1.7mm
R2 = CMP-00071-1: SMD Chip Resistor, 0603 [1608 Metric], 536 ohm, ERJ3EK Series, 75 V, Thick Film, 100 mW; Tolerance: 1%; Voltage Rating (DC): 50V; Voltage Rating: 75V; Power Rating: 100mW; Temperature Coefficient: 100ppm/°C; Max Operating Temperature: 155°C; Package Quantity: 1; REACH SVHC: No SVHC; Depth: 0.8mm; Composition: Thick Film; Height: 0.022inch; Packaging: Tape and Reel; Contact Plating: Tin; Lead Free: Lead Free; Length: 1.6mm; Case/Package: 0603; Military Standard: Not; Features: Automotive AEC-Q200; Termination: SMD/SMT; Max Power Dissipation: 100mW; Width: 0.8mm; Mount: Surface Mount; Case Code (Metric): 1608; Case Code (Imperial): 0603; Number of Terminations: 2; Min Operating Temperature: -55°C
R11 = CMP-00069-1: as R14 on sheet micro; Military Standard: Not; Termination: SMD/SMT; Number of Terminations: 2; Features: Moisture Resistant; Min Operating Temperature: -55°C; Power Rating: 100mW; Height: 0.022inch; Package Quantity: 1; Lead Free: Lead Free; Tolerance: 1%; Voltage Rating: 50V; Composition: Thick Film; Case Code (Imperial): 0603; Length: 1.6mm; Packaging: Tape and Reel; Case Code (Metric): 1608; Max Operating Temperature: 155°C; Depth: 0.8mm; Case/Package: 0603; Width: 0.031inch
U3 = CMP-044-0002-1: 500-mA, high-PSRR, low-IQ, low-dropout voltage regulator with enable 5-SOT-23 -40 to 125; Max Input Voltage: 5.5V; Quiescent Current: 31uA; Output Current: 500mA; Dropout Voltage: 238mV; Output Configuration: Positive; Output Type: Fixed; Number of Regulators: 1; Min Output Voltage: 3.3V; Power Supply Rejection Ratio (PSRR): 52dB; Max Operating Temperature: 125°C; Mount: Surface Mount; Max Output Voltage: 3.3V; Packaging: Cut Tape; Case/Package: SOT-23-5; Min Operating Temperature: -40°C

## Sheet CAN Interface.SchDoc
size A
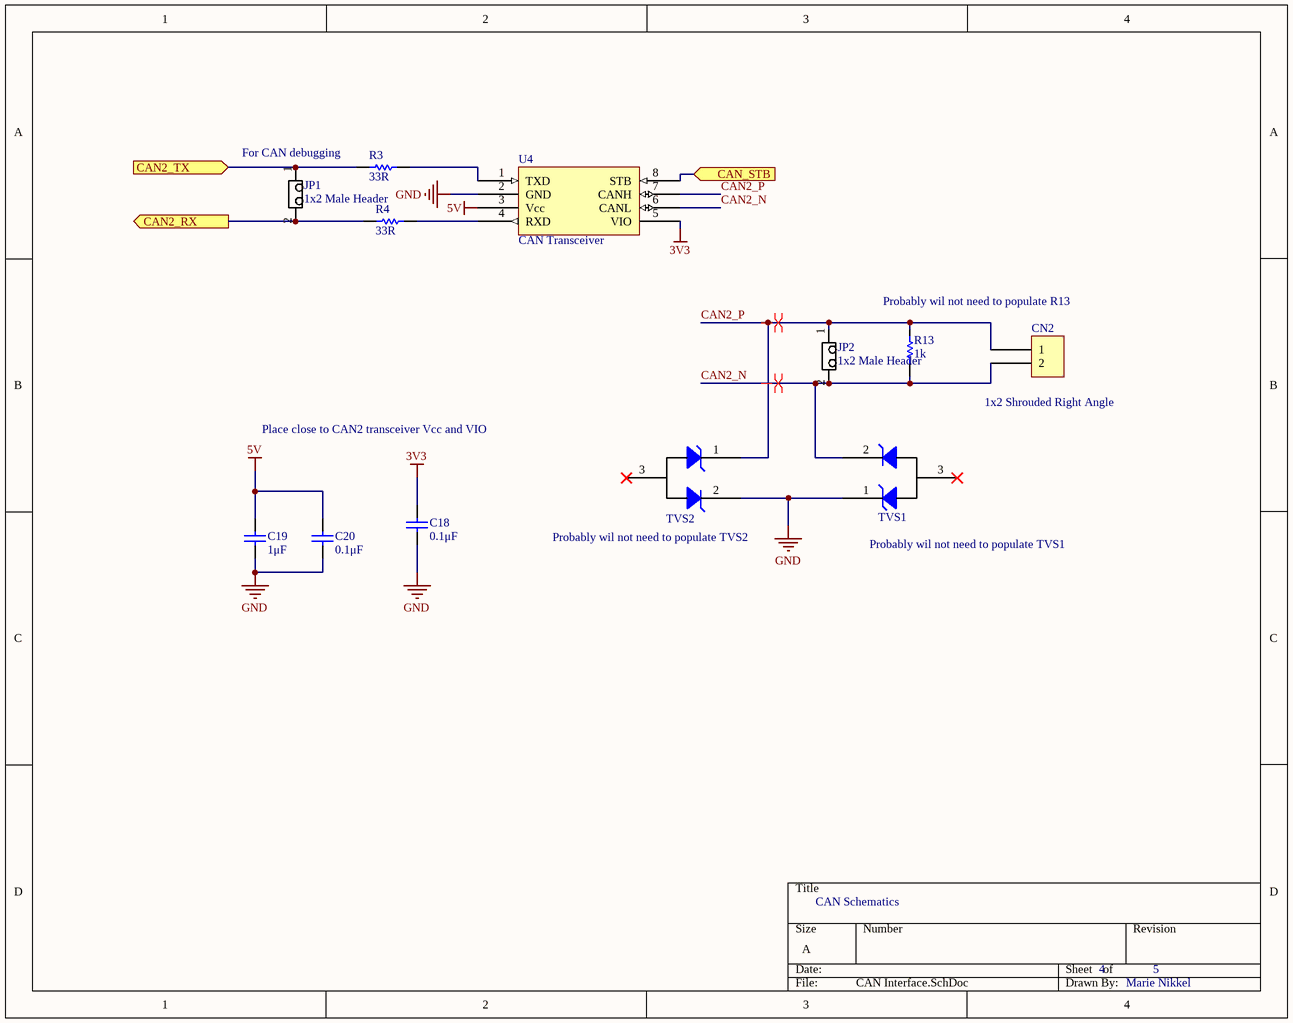
[diagram p3: CAN Interface.SchDoc]

### Parts
C18  0.1μF  [CAPC1608N(0603")]
C19  1μF  [CAPC1608N(0603")]
C20  0.1μF  [CAPC1608N(0603")]
CN2  1x2 Shrouded Right Angle  [2X1 Female Header]
JP1  1x2 Male Header  [2X1 Males Header]
JP2  1x2 Male Header  [2X1 Males Header]
R3  Resistance: 33R  [RESC1608X55X25NL10T15]  (hidden comment: RC0603FR-0733RL)
R4  Resistance: 33R  [RESC1608X55X25NL10T15]  (hidden comment: RC0603FR-0733RL)
R13  1k  [RESC1608N(0603")]
TVS1  PESD36VS2UT,215  [SOT95P245X110-3N]  (value not drawn)
TVS2  PESD36VS2UT,215  [SOT95P245X110-3N]  (value not drawn)
U4  CAN Transceiver  [8-SOIC]

### Ports
CAN2_RX (out), CAN2_TX (in), CAN_STB (in)

### Nets
3V3: C18.2(Cathode) U4.5(VIO)
5V: C19.2(Cathode) C20.2(Cathode) U4.3(Vcc)
GND: C18.1(Anode) C19.1(Anode) C20.1(Anode) TVS1.1(Cathode_1) TVS2.2(Cathode_2) U4.2(GND)
CAN2_N: CN2.2 JP2.2 R13.1 TVS1.2(Cathode_2) U4.6(CANL)
CAN2_P: CN2.1 JP2.1 R13.2 TVS2.1(Cathode_1) U4.7(CANH)
NetJP1_1: JP1.1 R3.1 ; port CAN2_TX
NetJP1_2: JP1.2 R4.1 ; port CAN2_RX
NetR3_2: R3.2 U4.1(TXD)
NetR4_2: R4.2 U4.4(RXD)
NetU2_48: U4.8(STB) ; port CAN_STB

Not connected (* = marked no-connect by the designer): TVS1 3(Common_Anode); TVS2 3(Common_Anode)

### Layout directives
differential pair: CAN2_N, CAN2_P

### Notes on the sheet
- For CAN debugging
- Probably wil not need to populate R13
- Place close to CAN2 transceiver Vcc and VIO
- (near TVS2) Probably wil not need to populate TVS2
- (near TVS1) Probably wil not need to populate TVS1
- CAN Schematics
- 4
- 5
- Marie Nikkel

### Library data of the parts
C18 C20 = 0.1uF 16V 0603 SMD, Ceramic: Capacitor, Ceramic, 16V, +/- 10%, 0603 SMD, X7R; Published: 16-04-26; Publisher: AUVic; PackageDescription: Chip Capacitor; Value: 0.1μF; Created By: Andy Bates; Supplier 1: Digi-Key; Supplier Part Number 1: 1276-1005-1-ND
C19 = 1uF 50V 0603 SMD, Ceramic: Capacitor, Ceramic, 50V, +/- 10%, 0603 SMD, X5R; PackageDescription: Chip Capacitor; Value: 1μF; Created By: Lyden Smith; Date Created: 2017-10-26; Supplier 1: Digi-Key; Supplier Part Number 1: 1276-1860-1-ND
CN2 = CMP-00010-3: 02 MTE HDR SRRA LATCH; PCB Mount Retention: Without; Number of Positions: 2; Row Spacing: 0.1inch; Contact Retention: Yes (With); PCB Mount Alignment: No (Without); Current Rating: 3A; PCB Thickness: 0.062inch; Insulation Resistance: 5GR; Gender: Male; Connector Type: Plug,Header,Pin; Tail Length: 3.3mm; Approvals: CSA; Pitch: 2.54mm; Contact Resistance: 15mR; Color: Black; REACH SVHC: Unknown; Contact Shape: Square; Number of Contacts: 2; PCB Mounting Orientation: Right Angle; Housing Material: Thermoplastic; Max Operating Temperature: 105°C; Mount: Through Hole; Package Quantity: 68; Contact Current Rating: 3A; Housing Color: Black; Contact Material: Brass; Min Operating Temperature: -65°C; Packaging: Rail/Tube; Height: 13.59mm; ELV: Compliant; Number of Rows: 1; Orientation: Right Angle; Lead Free: Lead Free; Mating Retention: Yes (With); Strain Relief: No (Without); Length: 7.62mm; Flammability Rating: UL94 V-0; Contact Plating: Gold,Tin,Matte; Contact Mating Length: 0.23inch; Contact Gender: Male; Termination: Crimp; Backwall/Post Interruptions: No (Without); Depth: 13.59mm; Mating Alignment: Yes (With)
JP1 JP2 = CMP-004-0001-1: Made By: Andy Bates; Source: AUVic_Schematic_Library_Connectors.SchLib; Pin Count: 2; Design Item ID: 1x2 Male Header; Component Type: Standard
R3 R4 = CMP-00060-1: Res Thick Film 0603 33 Ohm 1% 1/10W +/-100ppm/ßC Molded SMD Paper T/R; Max Power Dissipation: 100mW; Voltage Rating: 75V; Voltage Rating (DC): 50V; Temperature Coefficient: 100ppm/°C; Depth: 0.8mm; Military Standard: Not; Min Operating Temperature: -55°C; Termination: SMD/SMT; Weight: 7.1E-05oz; Number of Terminations: 2; Height: 0.45mm; Power Rating: 100mW; Composition: Thick Film; Length: 1.6mm; Packaging: Tape and Reel; Lead Pitch: 0.3mm; Lead Free: Lead Free; Max Operating Temperature: 155°C; REACH SVHC: No SVHC; Features: Moisture Resistant; Tolerance: 1%; Case/Package: 0603; Package Quantity: 1; Width: 0.8mm; Case Code (Metric): 1608; Number of Pins: 2; Case Code (Imperial): 0603
R13 = 1kR, 1%, 1/10W , 0603, SMD: Created By: Andy Bates; Publisher: AUVic; Date Created: 2017-05-10; Value: 1k; Supplier 1: Digikey; Supplier Part Number 1: 311-1.00KHRCT-ND
TVS1 TVS2 = PESD36VS2UT,215: TVS DIODE 36V 60V SOT23; Supplier 1: Digi-Key; Created By: Miguel Manguerra; Date Created: 2020-05-18; Supplier Part Number 1: 1727-5397-1-ND
U4 = CMP-032-0000-2: 1/1 Transceiver Half CANbus 8-SO; Data Rate: 1Mbps; Max Supply Voltage: 5.5V; Propagation Delay: 250ns; Number of Transceivers: 1; Nominal Supply Current: 70mA; Min Supply Voltage: 4.5V; Min Operating Temperature: -40°C; Radiation Hardening: No; Packaging: Tape and Reel; Turn-On Delay Time: 250ns; Case/Package: SO; Contact Plating: Gold; Package Quantity: 2500; Number of Pins: 8; Max Supply Current: 70mA; Max Operating Temperature: 150°C; Interface: CAN; Mount: Surface Mount; Lead Free: Lead Free

## Sheet LED and LCD.SchDoc
size A4
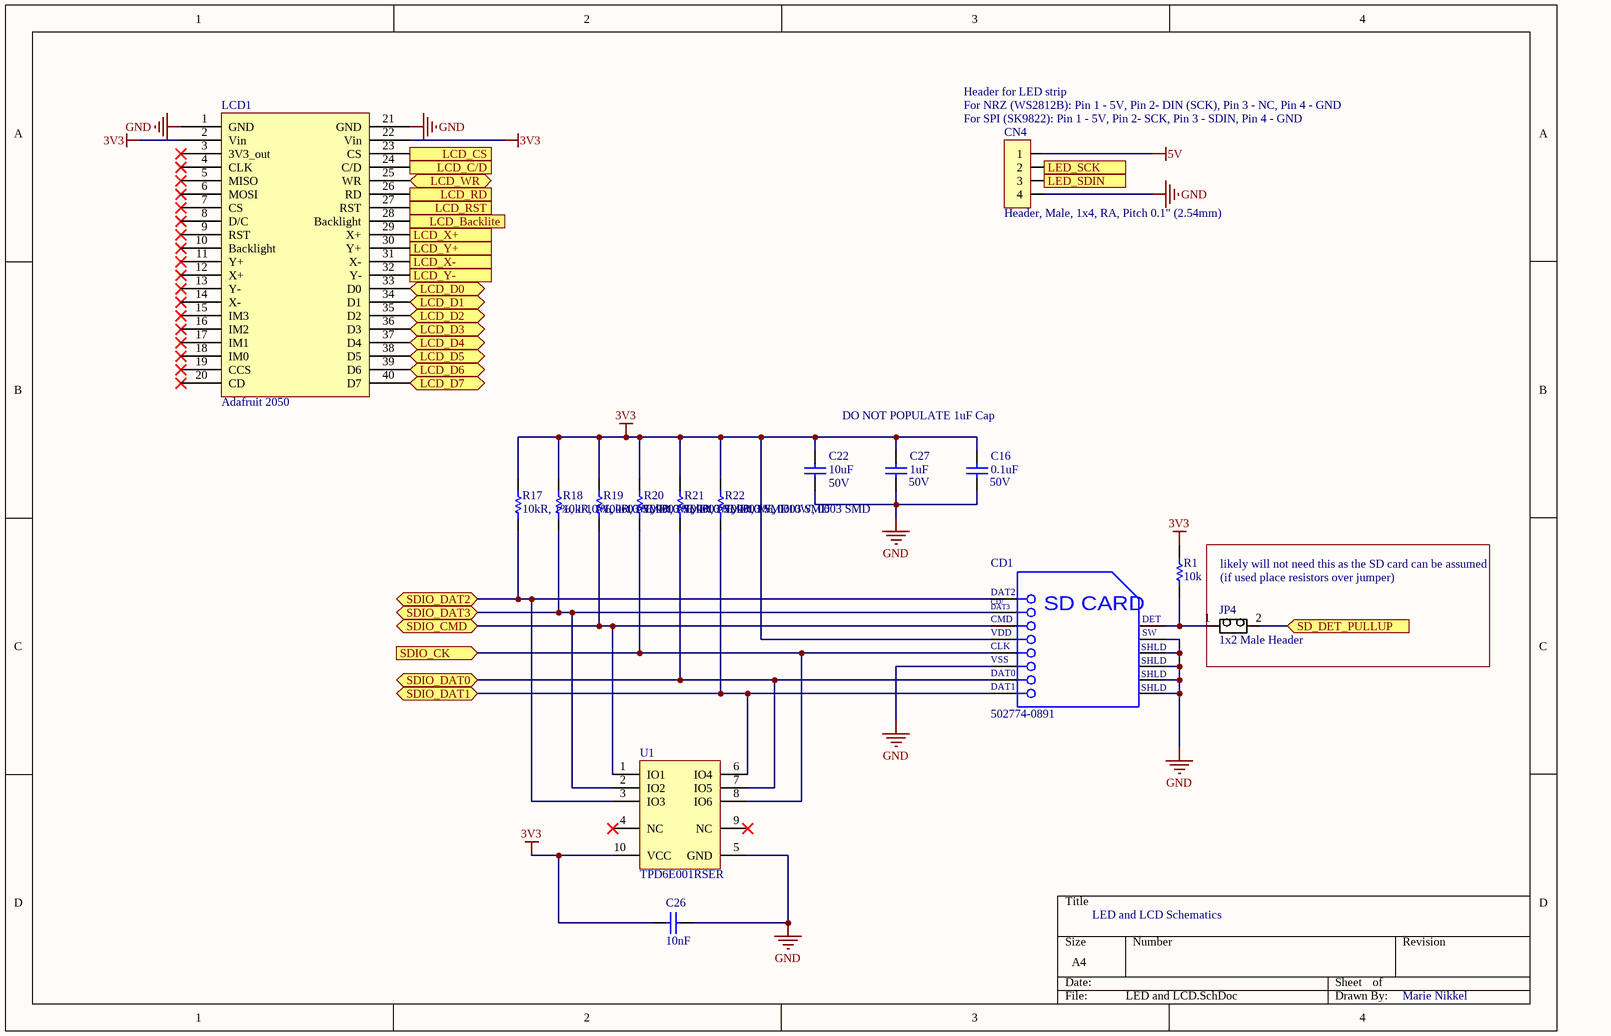
[diagram p4: LED and LCD.SchDoc]

### Parts
C16  Voltage: 50V  Capacitance: 0.1uF  [FP-CL10-0_1-IPC_A]  (hidden comment: CL10B104JB8NNNC)
C22  Voltage Rating (DC): 50V  Capacitance: 10uF  [CAPC3216X180X50ML20T30]  (hidden comment: CL31B106KBHNNNE)
C26  value 10nF  [CAPC1608N(0603")]  (hidden comment: 10 nF, 50V 0603 SMD, Ceramic)
C27  Capacitance: 1uF  Voltage: 50V  [0803 CAP]  (hidden comment: CL21B105KBFNNNG)
CD1  502774-0891  [MOLX-502774-0891_V]
CN4  Header, Male, 1x4, RA, Pitch 0.1" (2.54mm)  [HEADER, MALE, SHROUDED, 4x1, PITCH 0.1" (2.54mm), RA]
JP4  1x2 Male Header  [2X1 Males Header]
LCD1  Adafruit 2050  [LCD_touchscreen_tft]
R1  value 10k  [RESC1608N(0603")]  (hidden comment: 10kR, 1%, 1/10W, 0603 SMD)
R17  10kR, 1%, 1/10W, 0603 SMD  [RESC1608N(0603")]
R18  10kR, 1%, 1/10W, 0603 SMD  [RESC1608N(0603")]
R19  10kR, 1%, 1/10W, 0603 SMD  [RESC1608N(0603")]
R20  10kR, 1%, 1/10W, 0603 SMD  [RESC1608N(0603")]
R21  10kR, 1%, 1/10W, 0603 SMD  [RESC1608N(0603")]
R22  10kR, 1%, 1/10W, 0603 SMD  [RESC1608N(0603")]
U1  TPD6E001RSER  [RSE0010A_V]

### Ports
LCD_Backlite (in), LCD_C/D (in), LCD_CS (in), LCD_D0 (bidir), LCD_D1 (bidir), LCD_D2 (bidir), LCD_D3 (bidir), LCD_D4 (bidir), LCD_D5 (bidir), LCD_D6 (bidir), LCD_D7 (bidir), LCD_RD (in), LCD_RST (in), LCD_WR (bidir), LCD_X+ (out), LCD_X- (out), LCD_Y+ (out), LCD_Y- (out), LED_SCK (in), LED_SDIN (in), SD_DET_PULLUP (in), SDIO_CK (in), SDIO_CMD (bidir), SDIO_DAT0 (bidir), SDIO_DAT1 (bidir), SDIO_DAT2 (bidir), SDIO_DAT3 (bidir)

### Nets
3V3: C16.2 C22.2 C26.1(Anode) C27.2 CD1.4(VDD) LCD1.2(Vin) LCD1.22(Vin) R1.2 R17.2 R18.2 R19.2 R20.2 R21.2 R22.2 U1.10(VCC)
5V: CN4.1
GND: C16.1 C22.1 C26.2(Cathode) C27.1 CD1.6(VSS) CD1.10(SWITCH) CD1.11(SHLD) CD1.12(SHLD) CD1.13(SHLD) CD1.14(SHLD) CN4.4 LCD1.1(GND) LCD1.21(GND) U1.5(GND)
NetC14_2: LCD1.27(RST) ; port LCD_RST
NetCD1_1: CD1.1(DAT2) R17.1 U1.3(IO3) ; port SDIO_DAT2
NetCD1_2: CD1.2(CD/DAT3) R18.1 U1.2(IO2) ; port SDIO_DAT3
NetCD1_3: CD1.3(CMD) R19.1 U1.1(IO1) ; port SDIO_CMD
NetCD1_5: CD1.5(CLK) R20.1 U1.8(IO6) ; port SDIO_CK
NetCD1_7: CD1.7(DAT0) R21.1 U1.7(IO5) ; port SDIO_DAT0
NetCD1_8: CD1.8(DAT1) R22.1 U1.6(IO4) ; port SDIO_DAT1
NetCD1_9: CD1.9(DETECT) JP4.1 R1.1
NetCN4_2: CN4.2 ; port LED_SCK
NetCN4_3: CN4.3 ; port LED_SDIN
NetJP4_2: JP4.2 ; port SD_DET_PULLUP
NetLCD1_23: LCD1.23(CS) ; port LCD_CS
NetLCD1_24: LCD1.24(C/D) ; port LCD_C/D
NetLCD1_25: LCD1.25(WR) ; port LCD_WR
NetLCD1_26: LCD1.26(RD) ; port LCD_RD
NetLCD1_28: LCD1.28(Backlight) ; port LCD_Backlite
NetLCD1_29: LCD1.29(X+) ; port LCD_X+
NetLCD1_30: LCD1.30(Y+) ; port LCD_Y+
NetLCD1_31: LCD1.31(X-) ; port LCD_X-
NetLCD1_32: LCD1.32(Y-) ; port LCD_Y-
NetLCD1_33: LCD1.33(D0) ; port LCD_D0
NetLCD1_34: LCD1.34(D1) ; port LCD_D1
NetLCD1_35: LCD1.35(D2) ; port LCD_D2
NetLCD1_36: LCD1.36(D3) ; port LCD_D3
NetLCD1_37: LCD1.37(D4) ; port LCD_D4
NetLCD1_38: LCD1.38(D5) ; port LCD_D5
NetLCD1_39: LCD1.39(D6) ; port LCD_D6
NetLCD1_40: LCD1.40(D7) ; port LCD_D7

Not connected (* = marked no-connect by the designer): LCD1 3(3V3_out)* 4(CLK)* 5(MISO)* 6(MOSI)* 7(CS)* 8(D/C)* 9(RST)* 10(Backlight)* 11(Y+)* 12(X+)* 13(Y-)* 14(X-)* 15(IM3)* 16(IM2)* 17(IM1)* 18(IM0)* 19(CCS)* 20(CD)*; U1 4(NC)* 9(NC)*

### Notes on the sheet
- Header for LED strip
- (near CN4) For NRZ (WS2812B): Pin 1 - 5V, Pin 2- DIN (SCK), Pin 3 - NC, Pin 4 - GND
- (near CN4) For SPI (SK9822): Pin 1 - 5V, Pin 2- SCK, Pin 3 - SDIN, Pin 4 - GND
- DO NOT POPULATE 1uF Cap
- likely will not need this as the SD card can be assumed
- (if used place resistors over jumper)
- LED and LCD Schematics
- Marie Nikkel
- (in symbol CMP-2000-05248-1) CD/; DAT3; SD CARD; DET; SW

### Library data of the parts
C16 = CMP-00000-3: as C4 on sheet micro; Case Code (Imperial): 0603; Mount: Surface Mount; Thickness: 0.035inch; Depth: 0.8mm; Packaging: Tape and Reel; Package Quantity: 1; Dielectric: X7R; Height: 0.8mm; Radiation Hardening: No; Max Operating Temperature: 125°C; Voltage Rating: 50V; Case/Package: 0603; Min Operating Temperature: -55°C; Case Code (Metric): 1608; Length: 1.6mm; Contact Plating: Tin; Width: 0.031inch
C22 = CMP-00004-1: as C11 on sheet micro; Thickness: 0.071inch; Case/Package: 1206; Case Code (Metric): 3216; Case Code (Imperial): 1206; Voltage Rating: 50V; Length: 0.126inch; Max Operating Temperature: 125°C; Dielectric: X7R; Lead Free: Lead Free; Min Operating Temperature: -55°C; Tolerance: 10%; Mount: Surface Mount; Packaging: Tape and Reel; Width: 0.063inch
C26 = CMP-006-0010-1: Capacitor, Ceramic, 50V, +/- 10%, 0603 SMD; MFG: Samsung; MFG#: GRM188R61A475KE15D; Created By: Gabriel; Design Item ID: 10 nF, 50V 0603 SMD, Ceramic; PackageDescription: Chip Capacitor; Source: AUVic_Schematic_Library_Capacitors.SchLib; Published: 16-06-23; Pin Count: 2; Publisher: AUVic; Component Type: Standard
C27 = CMP-00005-3: SAMSUNG ELECTRO-MECHANICS - CL21B105KBFNNNG - MLCC CAPACITORS; Dielectric: X7R; Tolerance: 10%; Material: Ceramic; Min Operating Temperature: -55°C; Length: 2mm; Termination: Wraparound; Contact Plating: Tin; Package Quantity: 3000; Mount: Surface Mount; Max Operating Temperature: 125°C; Case Code (Imperial): 0805; Thickness: 0.053inch; Case/Package: 0805; Width: 0.049inch; Voltage Rating: 50V; Depth: 1.25mm; Packaging: Tape and Reel; Case Code (Metric): 2012
CD1 = CMP-2000-05248-1: Micro SD Memory Card Connector, 0.5 A, 10 V (DC), -25 to 85 degC, 8-Pin SMT, RoHS, Tape and Reel; Manufacturer: Molex; 3D Model: 502774-0891.stp; Online Catalog: microSD™Series; Number of Positions: 10(8+2); Card Type: SecureDigital-microSD™; Insertion, Removal Method: PushIn,PushOut; Other Names: WM24066DKR; Connector Type: ConnectorandEjector; Features: Switch; Family: MemoryConnectors-PCCardSockets; Manufacturer URL: http://www.molex.com/; Mounting Type: SurfaceMount,RightAngle; Contact Finish Thickness: 20µin(0.51µm); Standard Package: 1; Series: 502774; Ejector Side: -; Datasheet Version: Rev. D, 04/2004; Category: Connectors,Interconnects; Contact Finish: Gold; Datasheet URL: https://datasheet.ciiva.com/1104/1499551-1104671.pdf; RoHS Information: 502774-0891CertofCompliance; Mounting Feature: Reverse-Bottom; Packaging: Digi-Reel; Height Above Board: 0.071"(1.80mm); Catalog Drawings: 502774-0891
CN4 = CMP-005-0029-3: Connector Header Through Hole, Right Angle 4 position 0.100" (2.54mm); Pin Count: 4; Source: AUVic_Schematic_Library_Connectors.SchLib; Created On: 2020-05-20; Design Item ID: Header, Male, 1x4, RA, Pitch 0.1" (2.54mm); Component Type: Standard; Created By: Miguel Manguerra
JP4 = CMP-004-0001-1: Made By: Andy Bates; Source: AUVic_Schematic_Library_Connectors.SchLib; Pin Count: 2; Design Item ID: 1x2 Male Header; Component Type: Standard
LCD1 = CMP-033-0000-6: 3.5" TFT 320X480 TOUCHSCREEN; Component Type: Standard; ComponentLink5Description: Adafruit Guide; ComponentLink1URL: https://www.adafruit.com/product/1743; ComponentLink2URL: https://cdn-shop.adafruit.com/datasheets/ILI9341.pdf; ComponentLink3URL: https://cdn-shop.adafruit.com/datasheets/MI0283QT-11+V1.1.PDF; ComponentLink4URL: https://www.digikey.ca/products/en/optoelectronics/display-modules-lcd-oled-graphic/107?k=&pkeyword=&pv652=165&FV=ffe0006b%2Cfffc05f8&quantity=0&ColumnSort=0&page=1&pageSize=25; ComponentLink3Description: Raw LCD Datasheet; ComponentLink4Description: DigiKey; Pin Count: 40; ComponentLink5URL: https://cdn-learn.adafruit.com/downloads/pdf/adafruit-2-dot-8-color-tft-touchscreen-breakout-v2.pdf; ComponentLink1Description: Adafruit; Design Item ID: Adafruit 2050; ComponentLink2Description: Datasheet; Source: AUVic_Integrated_Library_LCDs.SchLib
R1 = CMP-047-0013-1: Owned By: AUVic; Made By: Ashwin Sira; Design Item ID: 10kR, 1%, 1/10W, 0603 SMD; Pin Count: 2; Component Type: Standard; Created On: 14-05-31; Last Edited: 14-05-31; Source: AUVic_Schematic_Library_Resistors.SchLib
R17-R22 = CMP-047-0013-1: as R5 on sheet micro; Design Item ID: 10kR, 1%, 1/10W, 0603 SMD; Pin Count: 2; Component Type: Standard; Created On: 14-05-31; Last Edited: 14-05-31; Source: AUVic_Schematic_Library_Resistors.SchLib
U1 = CMP-0326-00011-3: Low-Capacitance + / - 15 kV ESD Protection Array for High-Speed Data Interfaces, 6 Channels, -40 to +85 degC, 10-pin UQFN (RSE), Green (RoHS & no Sb/Br); Manufacturer: Texas Instruments; IO Capacitance(Typ)(pF): 1.5; IEC 61000-4-2 Contact(+/- kV): 8; IO Leakage Current(nA): 1; Serial ATA / eSATA: TRUE; Breakdown Voltage(Min)(V): 11; IEC 61000-4-2 Air-Gap(+/- kV): 15; SubFamily: ESD Solution; ComponentLink1Description: Manufacturer URL; Eco-Plan: Green (RoHS & no Sb/Br); PackageVersion: revD, Jan-2011; PackageReference: RSE0010A; ComponentLink3URL: SamplesURL:http://www.ti.com/product/tpd6e001#samples; Mounting Technology: Surface Mount; ComponentLink2URL: http://www.ti.com/general/docs/lit/getliterature.tsp?genericPartNumber=TPD6E001&fileType=pdf; PackageDescription: 10-Leads Plastic Quad Flatpack No-Lead, 2 x 1.5 x 0.55 mm Body, 0.5 mm Pitch; ComponentLink2Description: Datasheet; USB High Speed: TRUE; ComponentLink3Description: URL Link1; DatasheetVersion: SLLS685C; ComponentLink1URL: http://www.ti.com/; PartNumber: TPD6E001RSER; 1394 / Firewire: TRUE

## Nets that join several sheets
3V3: micro (24 pins), Power (C2.1 R11.1 U3.5), CAN Interface (C18.2 U4.5), LED and LCD (15 pins)
5V: micro (D3.K), Power (5 pins), CAN Interface (C19.2 C20.2 U4.3), LED and LCD (CN4.1)
GND: micro (35 pins), Power (6 pins), CAN Interface (6 pins), LED and LCD (14 pins)
NetC14_2: micro (5 pins), LED and LCD (LCD1.27)
NetCD1_1: micro (U2.78), LED and LCD (CD1.1 R17.1 U1.3)
NetCD1_2: micro (U2.79), LED and LCD (CD1.2 R18.1 U1.2)
NetCD1_3: micro (U2.83), LED and LCD (CD1.3 R19.1 U1.1)
NetCD1_5: micro (U2.80), LED and LCD (CD1.5 R20.1 U1.8)
NetCD1_7: micro (U2.65), LED and LCD (CD1.7 R21.1 U1.7)
NetCD1_8: micro (U2.66), LED and LCD (CD1.8 R22.1 U1.6)
NetCN4_2: micro (U2.1), LED and LCD (CN4.2)
NetCN4_3: micro (U2.5), LED and LCD (CN4.3)
NetJP1_1: micro (U2.52), CAN Interface (JP1.1 R3.1)
NetJP1_2: micro (U2.51), CAN Interface (JP1.2 R4.1)
NetJP4_2: micro (U2.55), LED and LCD (JP4.2)
NetLCD1_23: micro (U2.88), LED and LCD (LCD1.23)
NetLCD1_24: micro (U2.60), LED and LCD (LCD1.24)
NetLCD1_25: micro (U2.86), LED and LCD (LCD1.25)
NetLCD1_26: micro (U2.85), LED and LCD (LCD1.26)
NetLCD1_28: micro (U2.25), LED and LCD (LCD1.28)
NetLCD1_29: micro (U2.29), LED and LCD (LCD1.29)
NetLCD1_30: micro (U2.30), LED and LCD (LCD1.30)
NetLCD1_31: micro (U2.31), LED and LCD (LCD1.31)
NetLCD1_32: micro (U2.32), LED and LCD (LCD1.32)
NetLCD1_33: micro (U2.61), LED and LCD (LCD1.33)
NetLCD1_34: micro (U2.62), LED and LCD (LCD1.34)
NetLCD1_35: micro (U2.81), LED and LCD (LCD1.35)
NetLCD1_36: micro (U2.82), LED and LCD (LCD1.36)
NetLCD1_37: micro (U2.38), LED and LCD (LCD1.37)
NetLCD1_38: micro (U2.39), LED and LCD (LCD1.38)
NetLCD1_39: micro (U2.40), LED and LCD (LCD1.39)
NetLCD1_40: micro (U2.41), LED and LCD (LCD1.40)
NetU2_48: micro (U2.48), CAN Interface (U4.8)